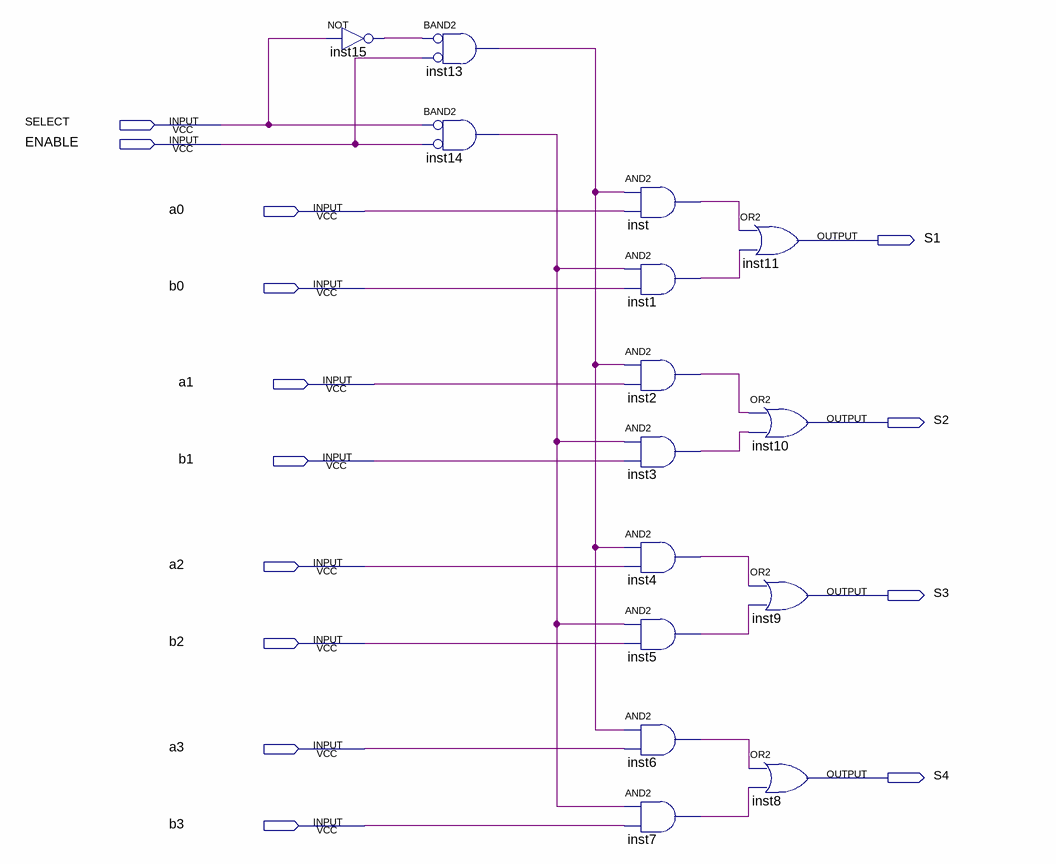
[diagram p0: schematic sheet]
// Quartus schematic CI74LS157_MUX.bdf as structural Verilog: 15 symbols, 14 pins
module CI74LS157_MUX (
  input  SELECT,
  input  ENABLE,
  input  a0,
  input  b0,
  input  a1,
  input  b1,
  input  a2,
  input  b2,
  input  a3,
  input  b3,
  output S1,
  output S2,
  output S3,
  output S4
);

  wire inst1_out, inst2_out, inst3_out, inst4_out, inst5_out, inst6_out, inst7_out, inst13_out, inst14_out,
       inst15_out, inst_out;

  not inst15 (inst15_out, SELECT);
  and inst13 (inst13_out, ~inst15_out, ~ENABLE);  // BAND2
  and inst14 (inst14_out, ~SELECT, ~ENABLE);  // BAND2
  and inst (inst_out, inst13_out, a0);
  and inst1 (inst1_out, inst14_out, b0);
  and inst2 (inst2_out, inst13_out, a1);
  and inst3 (inst3_out, inst14_out, b1);
  and inst4 (inst4_out, inst13_out, a2);
  and inst5 (inst5_out, inst14_out, b2);
  and inst6 (inst6_out, inst13_out, a3);
  and inst7 (inst7_out, inst14_out, b3);
  or inst11 (S1, inst_out, inst1_out);
  or inst10 (S2, inst2_out, inst3_out);
  or inst9 (S3, inst4_out, inst5_out);
  or inst8 (S4, inst6_out, inst7_out);
endmodule
